# EAGLE design mini-v1.12-macrofab (EAGLE 7.2.0)

## Sheet 1 of 4: Main Microcontroller
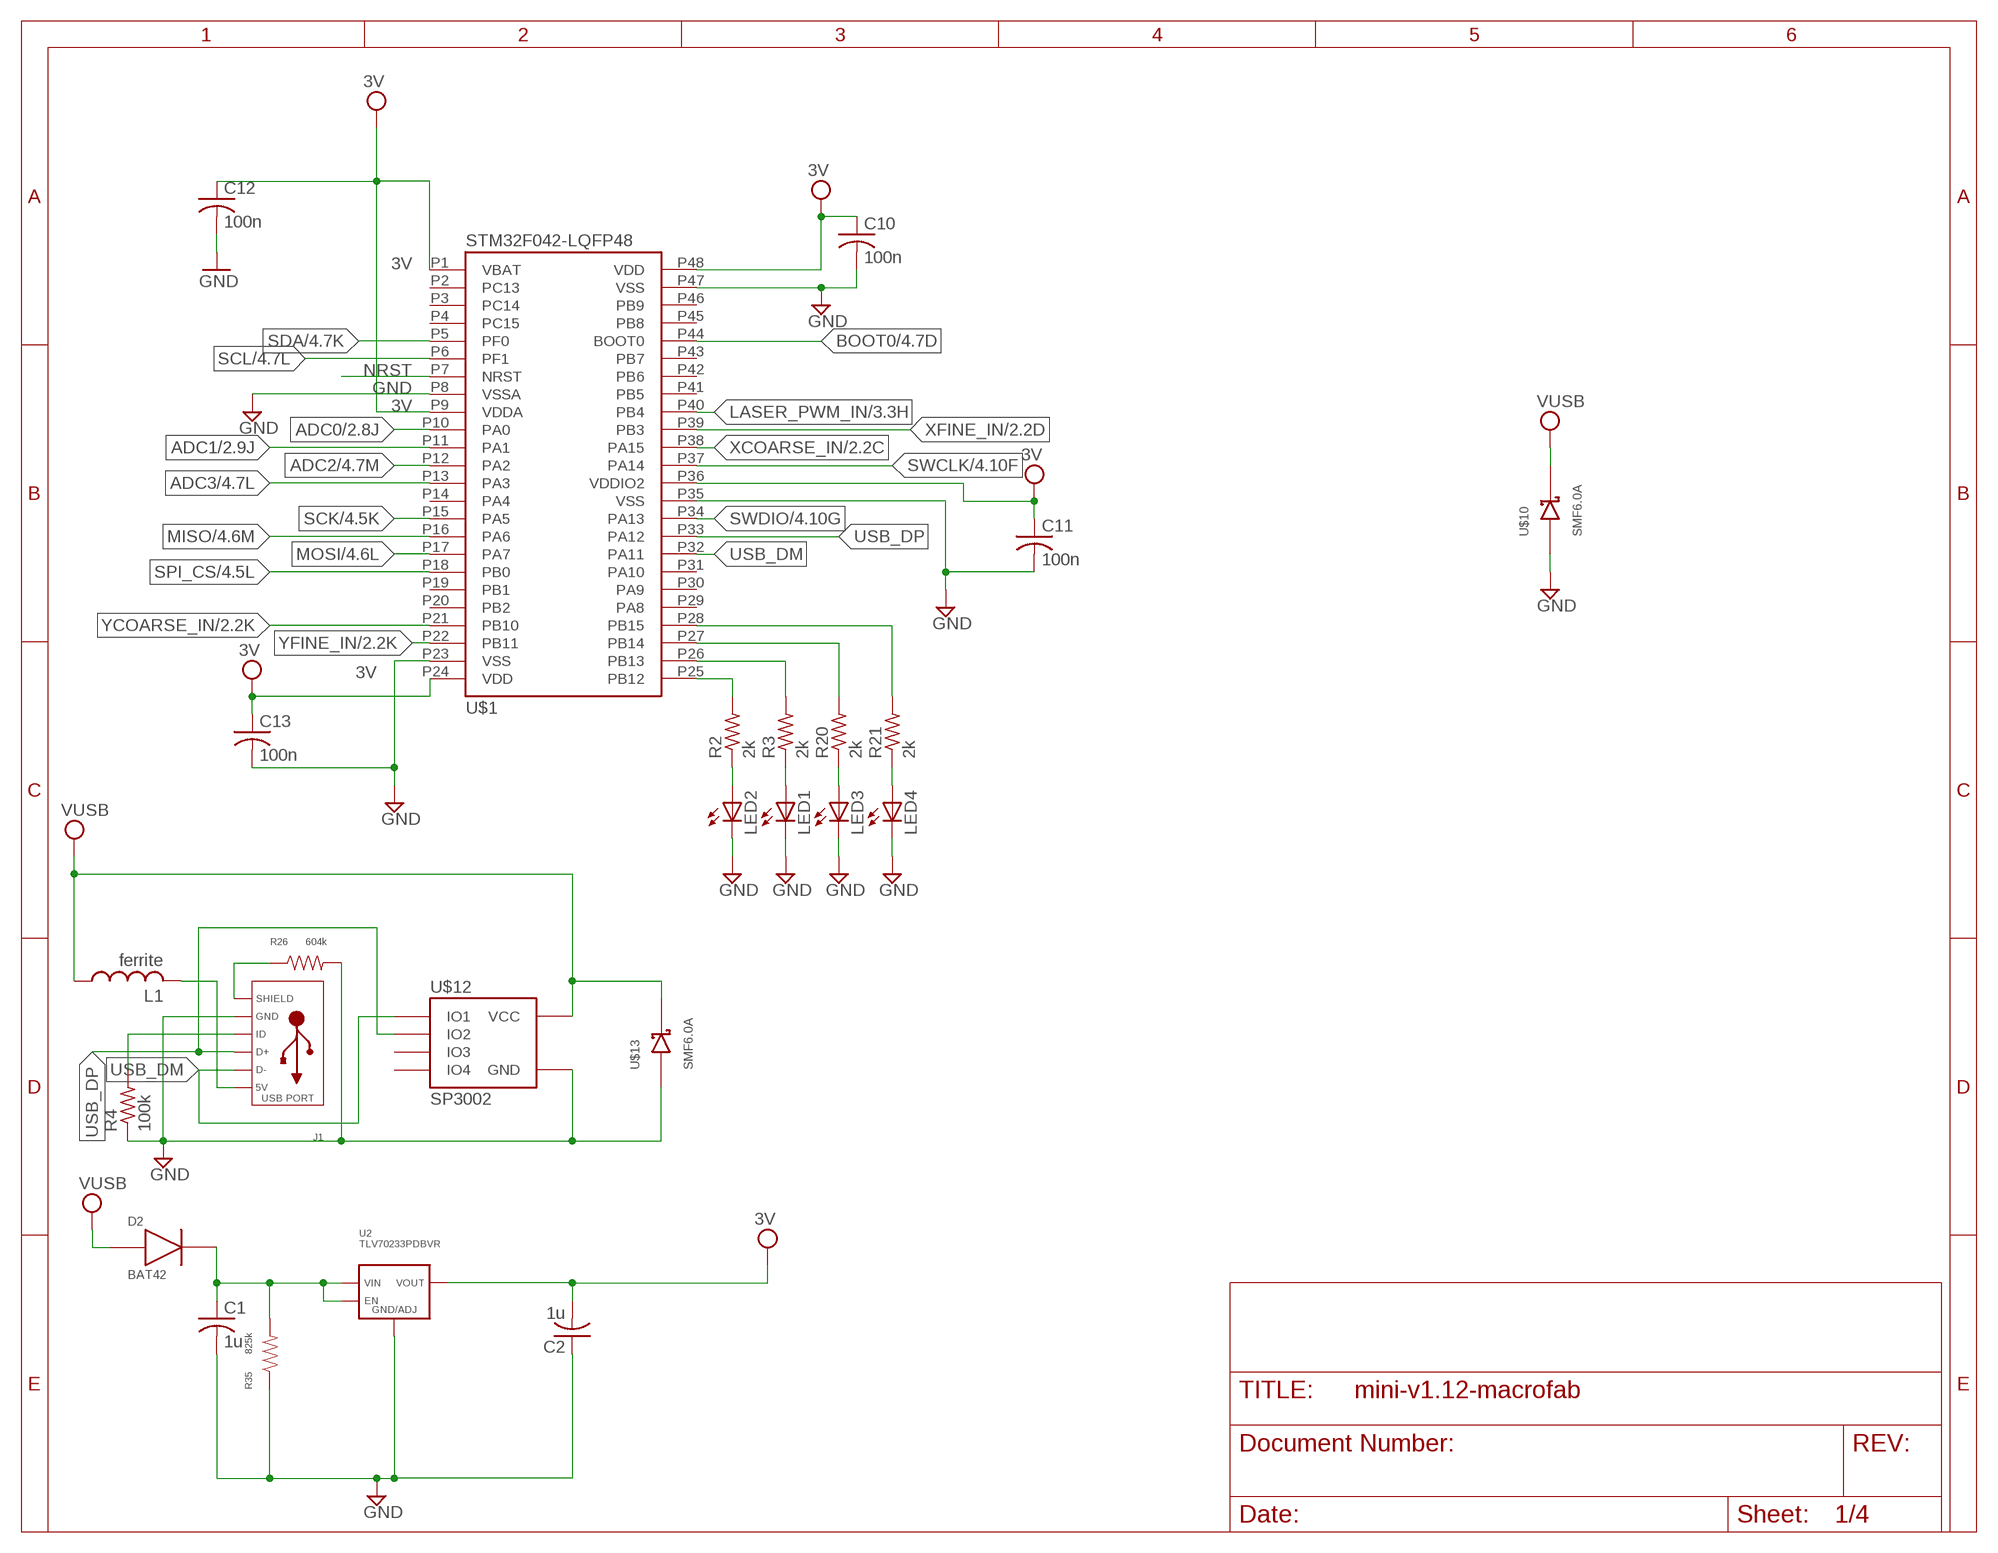
[diagram p0: schematic, sheet 1]

### Parts
C1  1u  C-USC0603  [C0603]
C2  1u  C-USC0603  [C0603]
C10  100n  C-USC0603  [C0603]
C11  100n  C-USC0603  [C0603]
C12  100n  C-USC0603  [C0603]
C13  100n  C-USC0603  [C0603]
D2  BAT42  BAT60A  [SOD323]
J1  USB_MICRO_RIGHT  [MICROUSB-RIGHT]
L1  ferrite  L-US  [C0603]
LED1  LEDCHIP-LED0603  [CHIP-LED0603]
LED2  LEDCHIP-LED0603  [CHIP-LED0603]
LED3  LEDCHIP-LED0603  [CHIP-LED0603]
LED4  LEDCHIP-LED0603  [CHIP-LED0603]
R2  2k  R-US_R0603  [R0603]
R3  2k  R-US_R0603  [R0603]
R4  100k  R-US_R0603  [R0603]
R20  2k  R-US_R0603  [R0603]
R21  2k  R-US_R0603  [R0603]
R26  604k  RESISTOR_0603  [R0603]
R35  825k  RESISTOR_0603  [R0603]
U2  TLV70233PDBVR  [SOT-23-5]
U$1  STM32F042-LQFP48  [LQFP48]
U$10  SMF6.0A  MBR0520  [SOD123]
U$12  SP3002  [SC70-6]
U$13  SMF6.0A  MBR0520  [SOD123]

### Nets
3V: C2.2 C10.1 C11.1 C12.1 C13.1 U2.P$5(VOUT) U$1.P1(VBAT) U$1.P9(VDDA) U$1.P24(VDD) U$1.P36(VDDIO2) U$1.P48(VDD) ; also sheet 2,4
ADC0: U$1.P10(PA0) ; also sheet 2
ADC1: U$1.P11(PA1) ; also sheet 2
ADC2: U$1.P12(PA2) ; also sheet 4
ADC3: U$1.P13(PA3) ; also sheet 4
BOOT0: U$1.P44(BOOT0) ; also sheet 4
GND [Power]: C1.2 C2.1 C10.2 C11.2 C12.2 C13.2 J1.5(GND) LED1.C LED2.C LED3.C LED4.C R4.1 R26.P$2 R35.P$1 U2.P$2(GND/ADJ) U$1.P8(VSSA) U$1.P23(VSS) U$1.P35(VSS) U$1.P47(VSS) U$10.ANODE U$12.P2(GND) U$13.ANODE ; also sheet 2,3,4
LASER_PWM_IN: U$1.P40(PB4) ; also sheet 3
MISO: U$1.P16(PA6) ; also sheet 4
MOSI: U$1.P17(PA7) ; also sheet 4
N$2: R2.2 U$1.P25(PB12)
N$3: LED2.A R2.1
N$4: C1.1 D2.1 R35.P$2 U2.P$1(VIN) U2.P$3(EN)
N$5: J1.4(ID) R4.2
N$12: LED1.A R3.1
N$13: R3.2 U$1.P26(PB13)
N$14: J1.1(5V) L1.2
N$18: J1.S1(SLD) J1.S2(SLD) J1.S3(SLD) J1.S4(SLD) J1.S5(SLD) J1.S6(SLD) R26.P$1
N$24: LED3.A R20.1
N$27: LED4.A R21.1
N$28: R20.2 U$1.P27(PB14)
N$29: R21.2 U$1.P28(PB15)
NRST: U$1.P7(NRST) ; also sheet 4
SCK: U$1.P15(PA5) ; also sheet 4
SCL: U$1.P6(PF1) ; also sheet 4
SDA: U$1.P5(PF0) ; also sheet 4
SPI_CS: U$1.P18(PB0) ; also sheet 4
SWCLK: U$1.P37(PA14) ; also sheet 4
SWDIO: U$1.P34(PA13) ; also sheet 4
USB_DM: J1.2(D-) U$1.P32(PA11) U$12.P1(IO1)
USB_DP: J1.3(D+) U$1.P33(PA12) U$12.P3(IO2)
VUSB [Power]: D2.2 L1.1 U$10.CATHODE U$12.P5(VCC) U$13.CATHODE ; also sheet 2,3,4
XCOARSE_IN: U$1.P38(PA15) ; also sheet 2
XFINE_IN: U$1.P39(PB3) ; also sheet 2
YCOARSE_IN: U$1.P21(PB10) ; also sheet 2
YFINE_IN: U$1.P22(PB11) ; also sheet 2
Unconnected: U$1.P2(PC13) U$1.P3(PC14) U$1.P4(PC15) U$1.P14(PA4) U$1.P19(PB1) U$1.P20(PB2) U$1.P29(PA8) U$1.P30(PA9) U$1.P31(PA10) U$1.P41(PB5) U$1.P42(PB6) U$1.P43(PB7) U$1.P45(PB8) U$1.P46(PB9) U$12.P4(IO3) U$12.P6(IO4)

## Sheet 2 of 4: Dual PWM
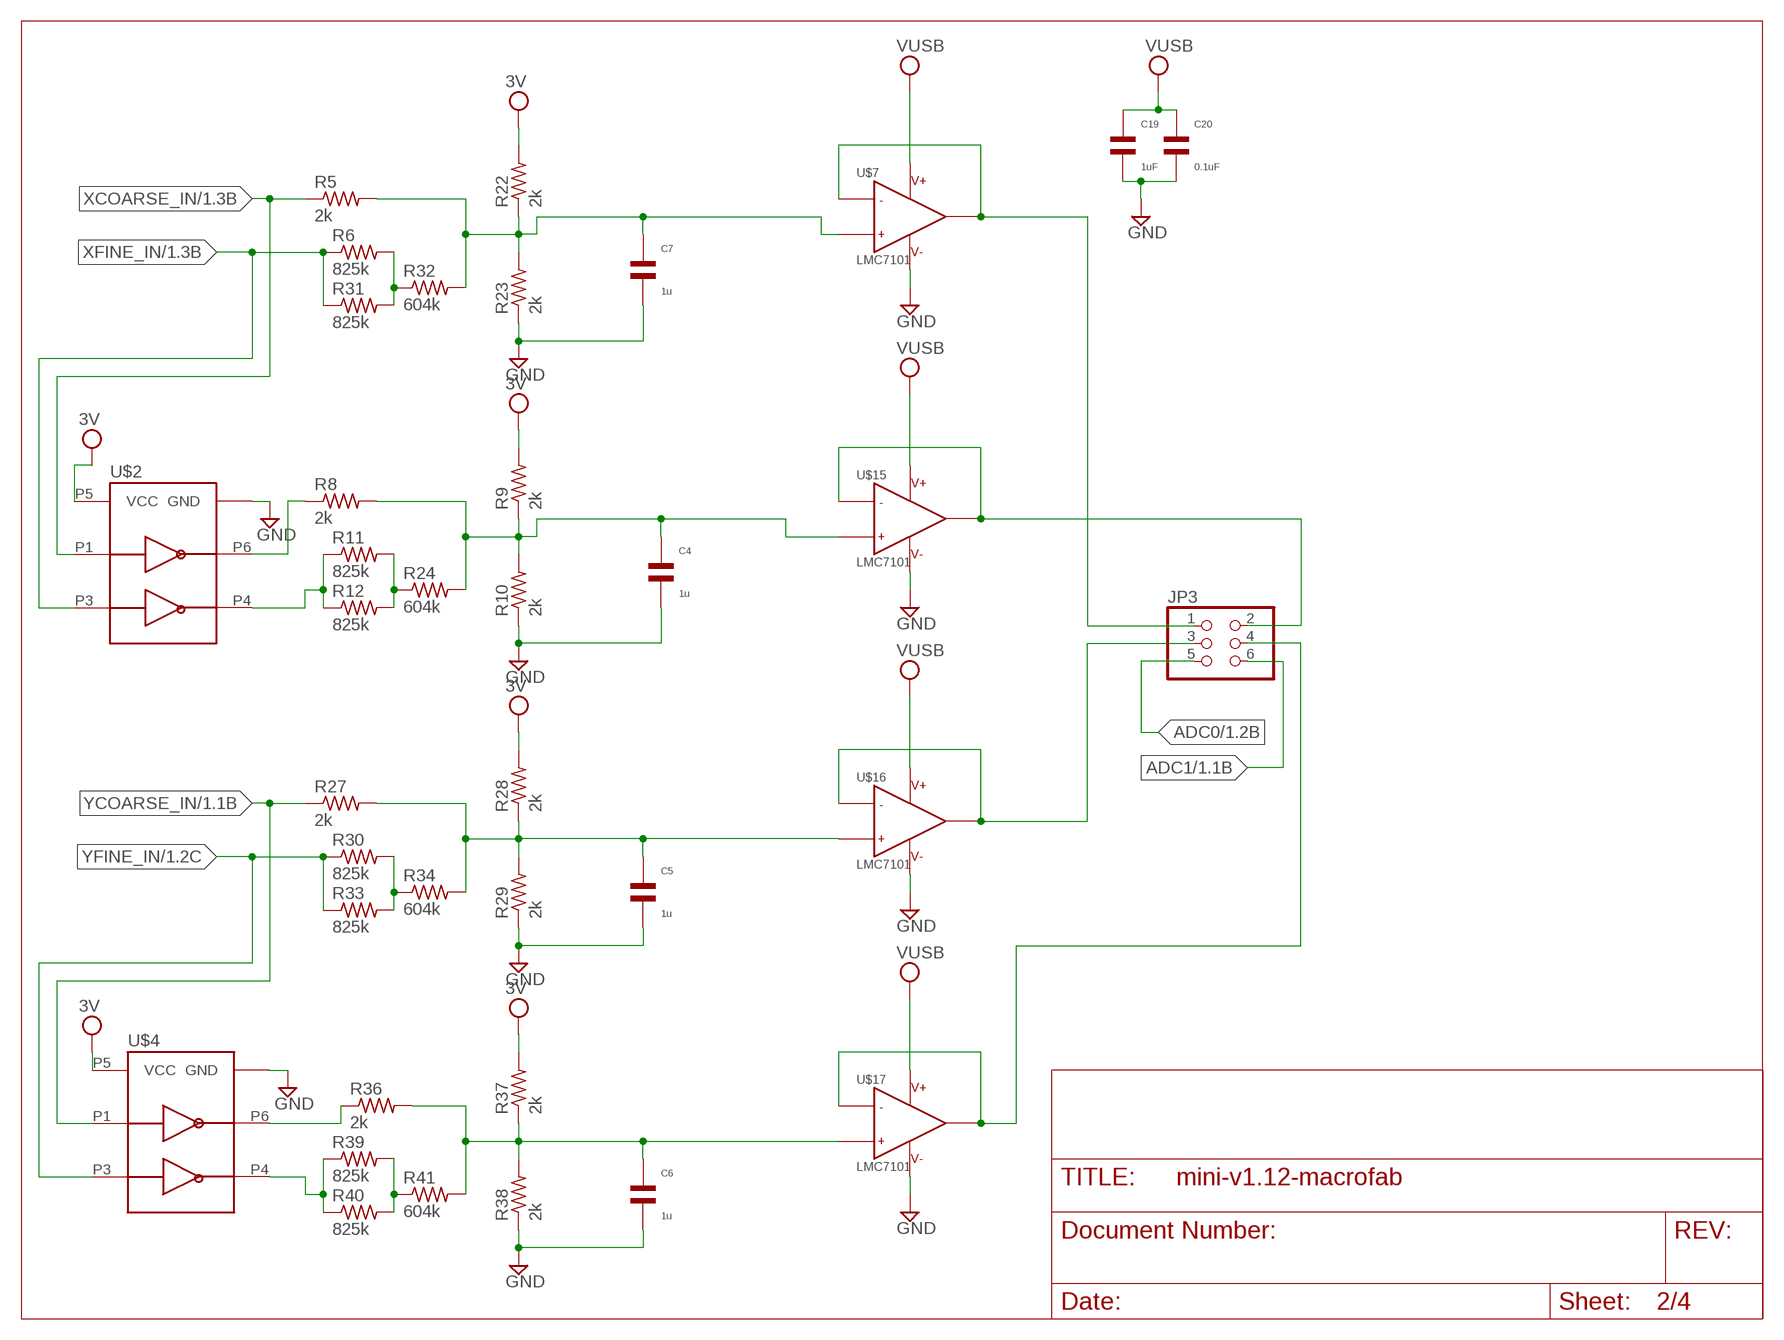
[diagram p1: schematic, sheet 2]

### Parts
C4  1u  CAPACITOR_NP_0603  [C0603]
C5  1u  CAPACITOR_NP_0603  [C0603]
C6  1u  CAPACITOR_NP_0603  [C0603]
C7  1u  CAPACITOR_NP_0603  [C0603]
C19  1uF  CAPACITOR_NP_0603  [C0603]
C20  0.1uF  CAPACITOR_NP_0603  [C0603]
JP3  PINHD-2X3  [2X03]
R5  2k  R-US_R0603  [R0603]
R6  825k  R-US_R0603  [R0603]
R8  2k  R-US_R0603  [R0603]
R9  2k  R-US_R0603  [R0603]
R10  2k  R-US_R0603  [R0603]
R11  825k  R-US_R0603  [R0603]
R12  825k  R-US_R0603  [R0603]
R22  2k  R-US_R0603  [R0603]
R23  2k  R-US_R0603  [R0603]
R24  604k  R-US_R0603  [R0603]
R27  2k  R-US_R0603  [R0603]
R28  2k  R-US_R0603  [R0603]
R29  2k  R-US_R0603  [R0603]
R30  825k  R-US_R0603  [R0603]
R31  825k  R-US_R0603  [R0603]
R32  604k  R-US_R0603  [R0603]
R33  825k  R-US_R0603  [R0603]
R34  604k  R-US_R0603  [R0603]
R36  2k  R-US_R0603  [R0603]
R37  2k  R-US_R0603  [R0603]
R38  2k  R-US_R0603  [R0603]
R39  825k  R-US_R0603  [R0603]
R40  825k  R-US_R0603  [R0603]
R41  604k  R-US_R0603  [R0603]
U$2  NC7WZ14P6X  [SC70-6]
U$4  NC7WZ14P6X  [SC70-6]
U$7  LMC7101  [SOT23-5]
U$15  LMC7101  [SOT23-5]
U$16  LMC7101  [SOT23-5]
U$17  LMC7101  [SOT23-5]

### Nets
3V: R9.2 R22.2 R28.2 R37.2 U$2.P5(VCC) U$4.P5(VCC) ; also sheet 1,4
ADC0: JP3.5 ; also sheet 1
ADC1: JP3.6 ; also sheet 1
COARSE1: R8.1 U$2.P6(Y1)
FINE1: R11.1 R12.1 U$2.P4(Y2)
FINE3: R39.1 R40.1 U$4.P4(Y2)
GND [Power]: C4.P$2 C5.P$2 C6.P$2 C7.P$2 C19.P$2 C20.P$2 R10.1 R23.1 R29.1 R38.1 U$2.P2(GND) U$4.P2(GND) U$7.5 U$15.5 U$16.5 U$17.5 ; also sheet 1,3,4
N$7: R36.1 U$4.P6(Y1)
N$8: R11.2 R12.2 R24.1
N$10: C4.P$1 R8.2 R9.1 R10.2 R24.2 U$15.3
N$30: R30.2 R33.2 R34.1
N$31: R6.2 R31.2 R32.1
N$32: C5.P$1 R27.2 R28.1 R29.2 R34.2 U$16.3
N$35: R39.2 R40.2 R41.1
N$36: C6.P$1 R36.2 R37.1 R38.2 R41.2 U$17.3
OUT: JP3.1 U$7.1 U$7.4
OUT1: JP3.2 U$15.1 U$15.4
OUT2: JP3.3 U$16.1 U$16.4
OUT3: JP3.4 U$17.1 U$17.4
VUSB [Power]: C19.P$1 C20.P$1 U$7.2 U$15.2 U$16.2 U$17.2 ; also sheet 1,3,4
XCOARSE_IN: R5.1 U$2.P1(A1) ; also sheet 1
XFINE_IN: R6.1 R31.1 U$2.P3(A2) ; also sheet 1
XSUM: C7.P$1 R5.2 R22.1 R23.2 R32.2 U$7.3
YCOARSE_IN: R27.1 U$4.P1(A1) ; also sheet 1
YFINE_IN: R30.1 R33.1 U$4.P3(A2) ; also sheet 1

## Sheet 3 of 4: Laser Power Driver
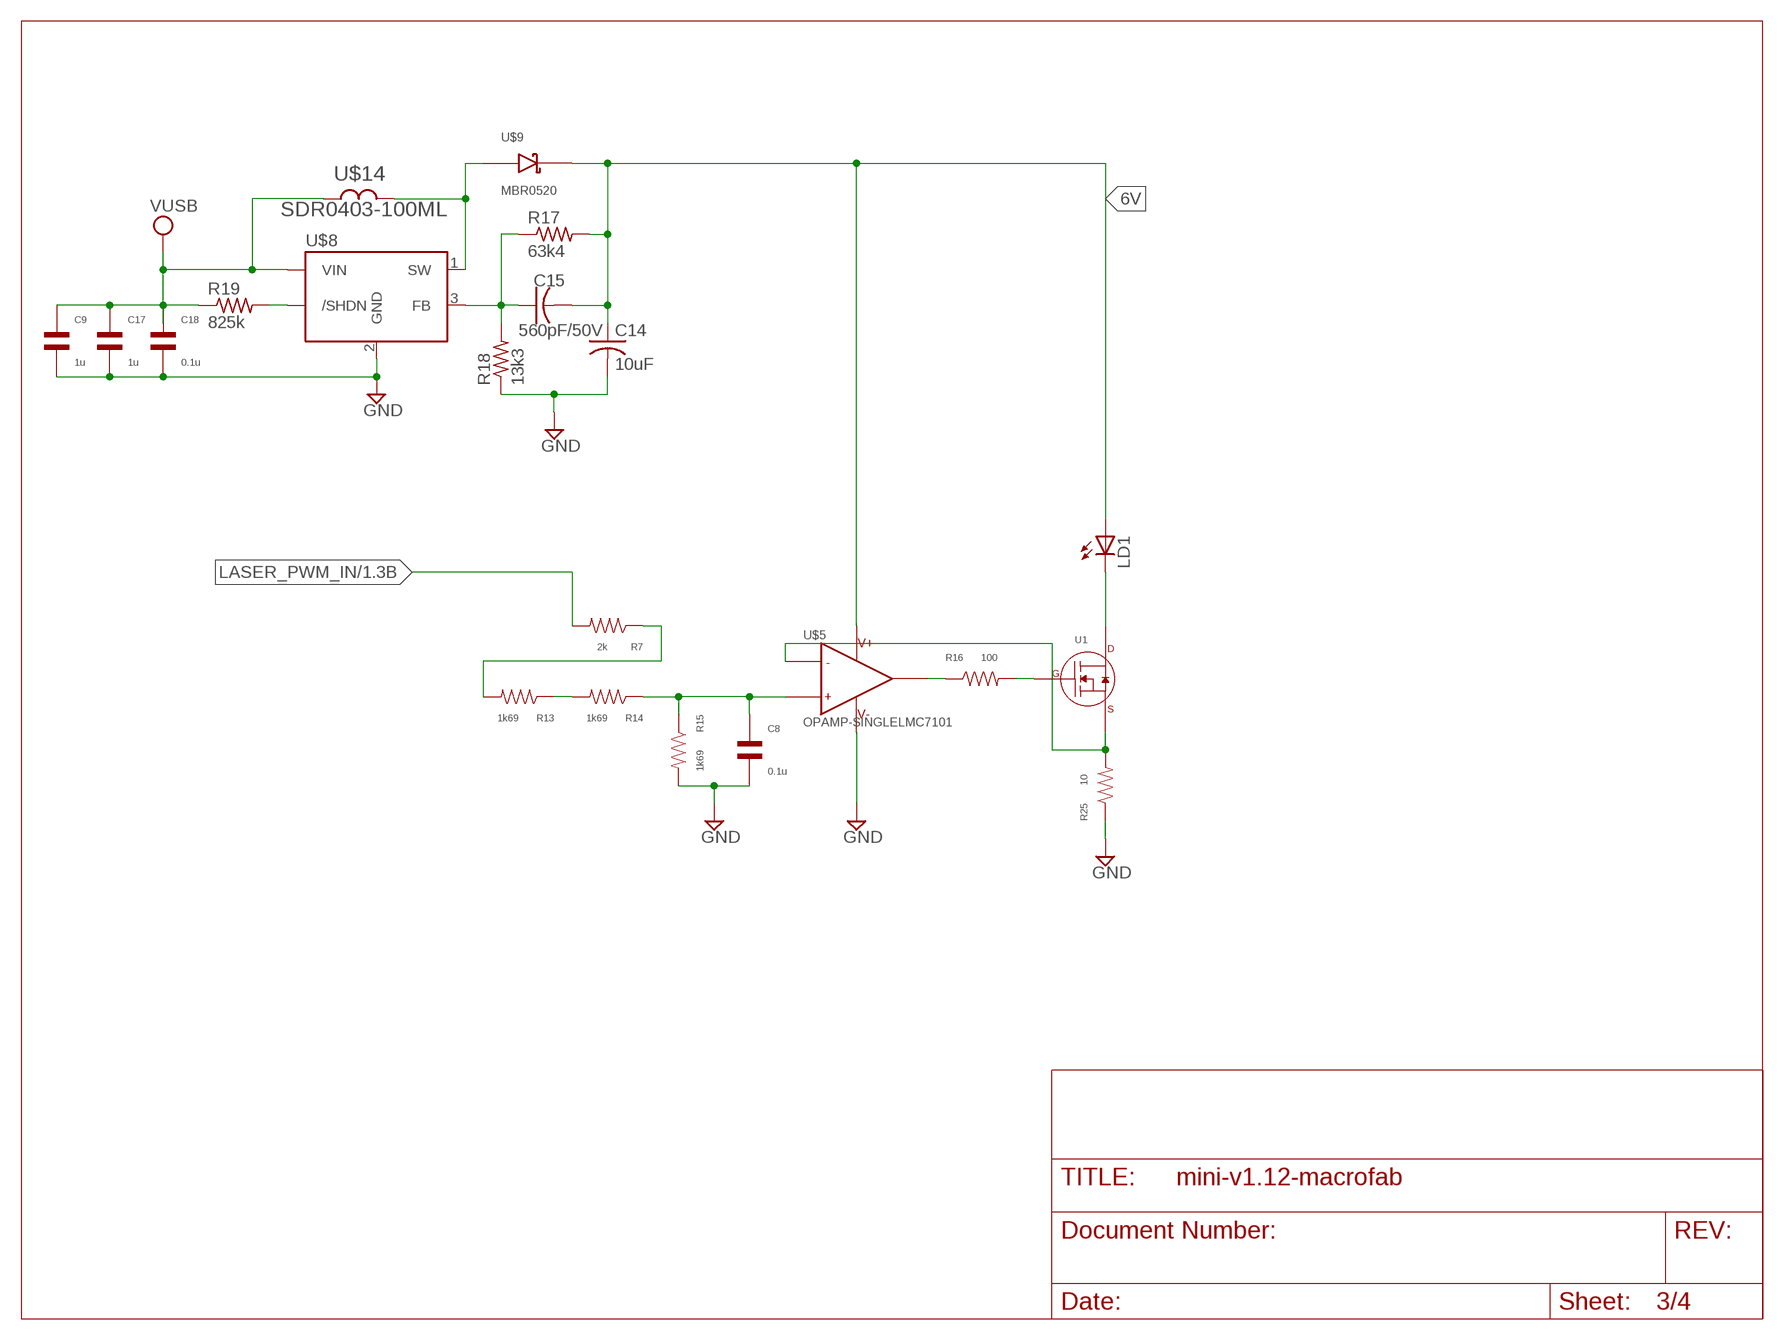
[diagram p2: schematic, sheet 3]

### Parts
C8  0.1u  CAPACITOR_NP_0603  [C0603]
C9  1u  CAPACITOR_NP_0603  [C0603]
C14  10uF  C-USC0603  [C0603]
C15  560pF/50V  C-USC0603  [C0603]
C17  1u  CAPACITOR_NP_0603  [C0603]
C18  0.1u  CAPACITOR_NP_0603  [C0603]
LD1  LASERDIODELD2  [LASERDIODE2]
R7  2k  RESISTOR_0603  [R0603]
R13  1k69  RESISTOR_0603  [R0603]
R14  1k69  RESISTOR_0603  [R0603]
R15  1k69  RESISTOR_0603  [R0603]
R16  100  RESISTOR_0603  [R0603]
R17  63k4  R-US_R0603  [R0603]
R18  13k3  R-US_R0603  [R0603]
R19  825k  R-US_R0603  [R0603]
R25  10  RESISTOR_0603  [R0603]
U1  N-CHANNEL_FET_SOT-23-3  [SOT-23-3]
U$5  OPAMP-SINGLELMC7101  [SOT23-5]
U$8  LMR62014  [SOT23-5]
U$9  MBR0520  [SOD123]
U$14  SDR0403-100ML  SDR0403  [SDR0403]

### Nets
6V [Power]: C14.1 C15.2 LD1.P$1(A) R17.2 U$5.2(V+) U$9.CATHODE
GND [Power]: C8.P$2 C9.P$2 C14.2 C17.P$2 C18.P$2 R15.P$2 R18.1 R25.P$1 U$5.5(V-) U$8.2(GND) ; also sheet 1,2,4
LASER_PWM_IN: R7.P$2 ; also sheet 1
N$6: R7.P$1 R13.P$2
N$9: R13.P$1 R14.P$2
N$11: C8.P$1 R14.P$1 R15.P$1 U$5.3(IN+)
N$15: U$8.1(SW) U$9.ANODE U$14.P$2
N$16 [Power]: LD1.P$3(C) U1.P$3(DRAIN)
N$17 [Power]: R25.P$2 U1.P$2(SOURCE) U$5.4(IN-)
N$19 [Power]: R16.P$2 U1.P$1(GATE)
N$20: R16.P$1 U$5.1(OUT)
N$25: C15.1 R17.1 R18.2 U$8.3(FB)
N$26: R19.2 U$8.4(/SHDN)
VUSB [Power]: C9.P$1 C17.P$1 C18.P$1 R19.1 U$8.5(VIN) U$14.P$1 ; also sheet 1,2,4

## Sheet 4 of 4
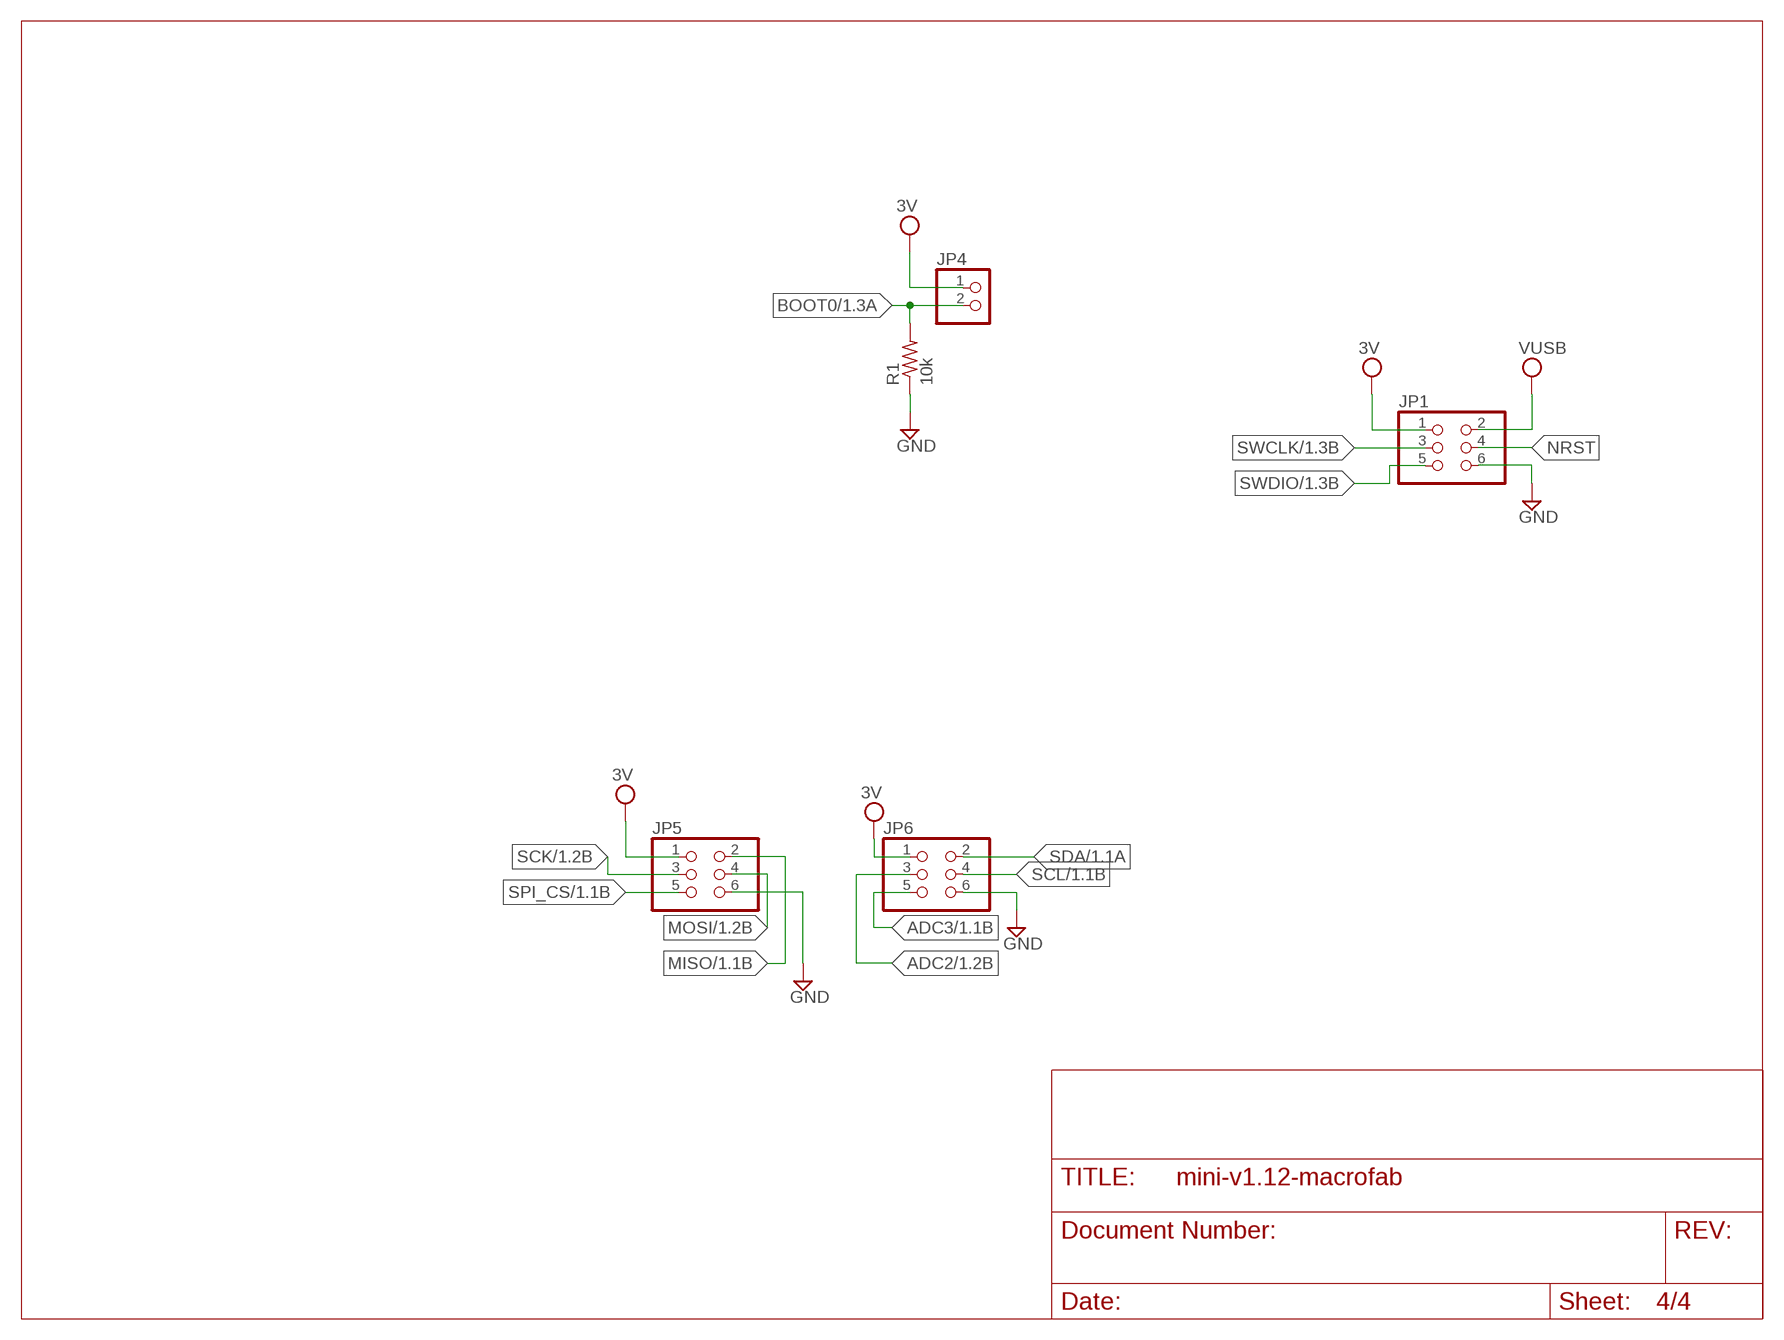
[diagram p3: schematic, sheet 4]

### Parts
JP1  PINHD-2X3  [2X03]
JP4  PINHD-1X2  [1X02]
JP5  PINHD-2X3  [2X03]
JP6  PINHD-2X3  [2X03]
R1  10k  R-US_R0603  [R0603]

### Nets
3V: JP1.1 JP4.1 JP5.1 JP6.1 ; also sheet 1,2
ADC2: JP6.3 ; also sheet 1
ADC3: JP6.5 ; also sheet 1
BOOT0: JP4.2 R1.2 ; also sheet 1
GND [Power]: JP1.6 JP5.6 JP6.6 R1.1 ; also sheet 1,2,3
MISO: JP5.2 ; also sheet 1
MOSI: JP5.4 ; also sheet 1
NRST: JP1.4 ; also sheet 1
SCK: JP5.3 ; also sheet 1
SCL: JP6.4 ; also sheet 1
SDA: JP6.2 ; also sheet 1
SPI_CS: JP5.5 ; also sheet 1
SWCLK: JP1.3 ; also sheet 1
SWDIO: JP1.5 ; also sheet 1
VUSB [Power]: JP1.2 ; also sheet 1,2,3

## Library data of the parts
C1 C2 C10-C15 = rcl:C-US: CAPACITOR, American symbol
C4-C9 C17-C20 = MF_Passives:CAPACITOR_NP: Library: MF_Passives Description: Device for Non-Polarized Capacitors. Manufacture part number (MFG#), Voltage, Temperature Coefficient, and Tolerance can be added via Attributes.; MFG#: N/A; TEMP_COF: N/A; TOLERANCE: N/A; VOLTAGE: N/A
D2 = lmdparts:BAT60A
J1 = MF_Connectors:USB: Library: MF_Connectors Description: 5 Pin USB Connectors. SLD is the shield connection. Usually tied to ground through a small ferrite bead.
JP1 JP3 JP5 JP6 = pinhead:PINHD-2X3: PIN HEADER
JP4 = pinhead:PINHD-1X2: PIN HEADER
L1 = lmdparts:L-US: INDUCTOR, American symbol
LD1 = Scott:LASERDIODE; MPN: 3 x (0552-2-15-15-11-27-10-0)
LED1-LED4 = adafruit:LED: LED OSRAM: - CHIPLED LG R971, LG N971, LY N971, LG Q971, LY Q971, LO R971, LY R971 LH N974, LH R974 LS Q976, LO Q976, LY Q976 LO Q996 - Hyper CHIPLED LW Q18S LB Q993, LB Q99A, LB R99A - SideLED LS A670, LO A670, LY A670, LG A670, LP A670 LB A673, LV A673, LT A673, LW A673 LH A674 LY A675 LS A676, LA A676, LO A676, LY A676, LW A676 LS A679, LY A679, LG A679 - Hyper Micro SIDELED® LS Y876, LA Y876, LO Y876, LY Y876 LT Y87S - SmartLED LW L88C, LW L88S LB L89C, LB L89S, LG L890 LS L89K, LO L89K, LY L89K LS L896, LA L896, LO L896, LY L896 - TOPLED LS T670, LO T670, LY T670, LG T670, LP T670 LSG T670, LSP T670, LSY T670, LOP T670, LYG T670 LG T671, LOG T671, LSG T671 LB T673, LV T673, LT T673, LW T673 LH T674 LS T676, LA T676, LO T676, LY T676, LB T676, LH T676, LSB T676, LW T676 LB T67C, LV T67C, LT T67C, LS T67K, LO T67K, LY T67K, LW E67C LS E67B, LA E67B, LO E67B, LY E67B, LB E67C, LV E67C, LT E67C LW T67C LS T679, LY T679, LG T679 LS T770, LO T770, LY T770, LG T770, LP T770 LB T773, LV T773, LT T773, LW T773 LH T774 LS E675, LA E675, LY E675, LS T675 LS T776, LA T776, LO T776, LY T776, LB T776 LHGB T686 LT T68C, LB T68C - Hyper Mini TOPLED® LB M676 - Mini TOPLED Santana® LG M470 LS M47K, LO M47K, LY M47K Source: http://www.osram.convergy.de/
R1-R6 R8-R12 R17-R24 R27-R34 R36-R41 = rcl:R-US_: RESISTOR, American symbol
R7 R13-R16 R25 R26 R35 = MF_Passives:RESISTOR: Library: MF_Passives Description: Device for Resistors. Manufacture part number (MFG#), Voltage, Tolerance, and Wattage Rating can be added via Attributes.; MFG#: N/A; TOLERANCE: N/A; VOLTAGE: N/A; WATTAGE: N/A
U1 = MF_Discrete_Semiconductor:N-CHANNEL_FET: Library: MF_Discrete_Semiconductor Description: Device for Single N-Channel Mosfet. Manufacture part number (MFG#) can be added via Attributes.
U2 = MF_IC_Power:TLV702: Manufacturer Part #: TLV702 Manufacturer: Texas Instruments Description: LDO Voltage Regulators
U$1 = lmdparts:STM32F042-LQFP48
U$2 U$4 = lmdparts:NC7WZ14P6X: 2-circuit logic inverter, ultra-high-speed and cheap
U$5 = lmdparts:OPAMP-SINGLE: Single amp opamps
U$7 U$15-U$17 = lmdparts:LMC7101
U$8 = lmdparts:LMR62014
U$9 U$10 U$13 = lmdparts:MBR0520
U$12 = lmdparts:SP3002
U$14 = lmdparts:SDR0403

## Net classes
1 Power: width 0.305 mm

## Board
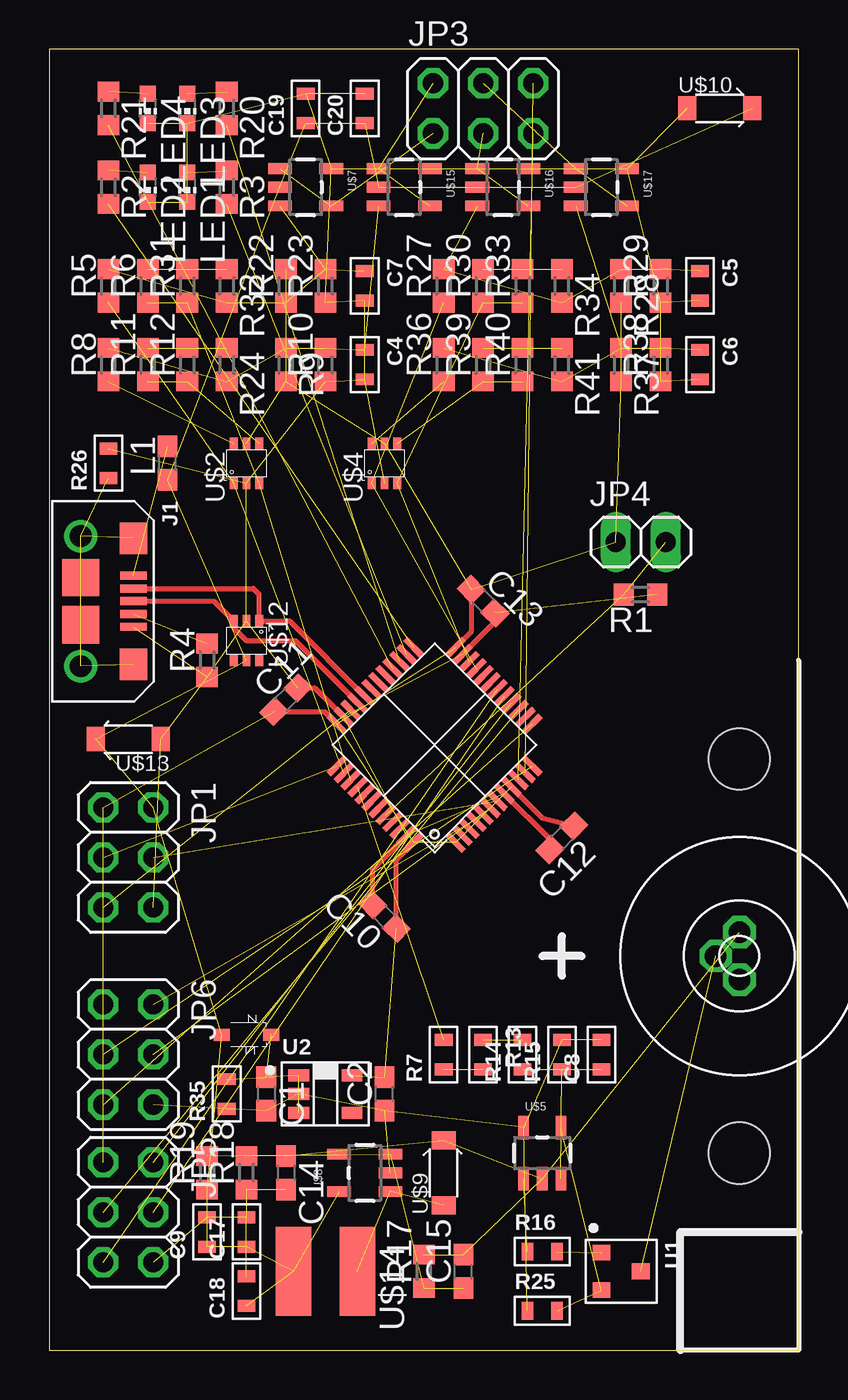
[diagram p4: board, top side]
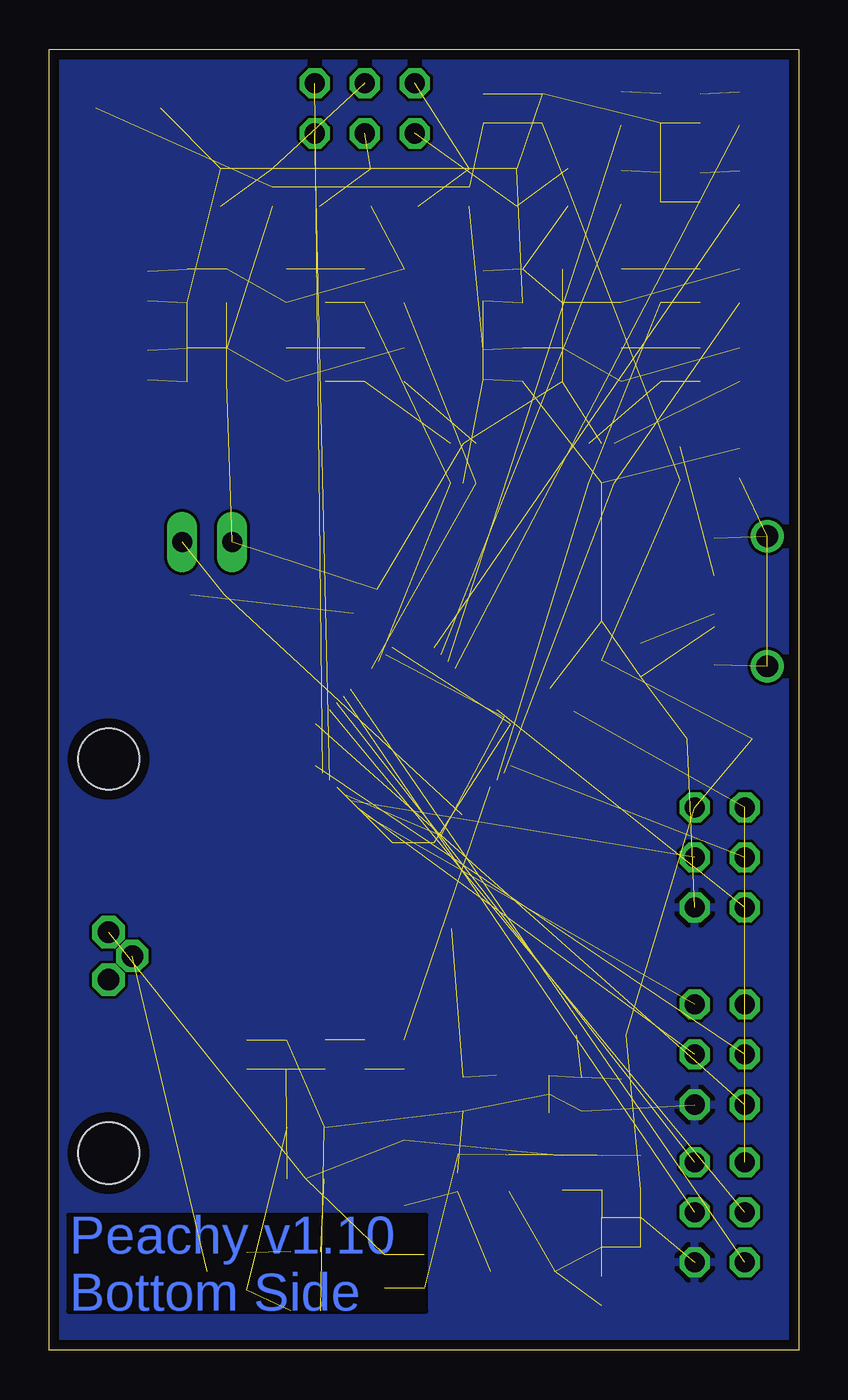
[diagram p5: board, bottom side, seen from below]

Size 38.01 x 66 mm. Coordinates in mm from the lower left corner, seen from the top.
Outline: 0,0 38.01,0 38,66 0,66 0,0
Copper layers (1*16): Top 0.035mm / dielectric 1.5mm / Bottom 0.035mm
Design rules "SeeedStudio_2layer_DRU_no_angle_20140221 *": minimum track width 6mil, minimum drill 12mil, track to track 6mil, track to pad 6mil, pad to pad 6mil, via to via 6mil, smd to smd 0mil, copper to edge 20mil, drill to drill 10mil, minimum pad ring 10mil, minimum via ring 6mil, stop-mask expansion 2mil, vias tented up to drill 100mil, thermal gap 10mil
Holes 3.1 mm at 35,10 35,30

### Footprints (pad centres in the part's own frame; a part is rotated, then mirrored left to right if it is on the bottom)
C0603 = smd 1.1 x 1: 1 -0.85,0; 2 0.85,0
C0603' = smd 0.6 x 0.9: P$1 -0.75,0; P$2 0.75,0
SOD323 = smd 0.6 x 0.8: 1 0,1.25; 2 0,-1.25
MICROUSB-RIGHT = smd 0.4 x 1.35: 1 -1.3,1.27; 2 -0.65,1.27; 3 0,1.27; 4 0.65,1.27; 5 1.3,1.27 | drill 1.1: S1 -3.3,-1.405; S2 3.3,-1.405 | smd 1.6 x 1.4: S3 -3.2,1.27; S4 3.2,1.27 | smd 1.9 x 1.9: S5 -1.2,-1.405; S6 1.2,-1.405
2X03 = drill 1.016 octagon: 1 -2.54,-1.27; 2 -2.54,1.27; 3 0,-1.27; 4 0,1.27; 5 2.54,-1.27; 6 2.54,1.27
1X02 = drill 1.016 long: 1 -1.27,0; 2 1.27,0
LASERDIODE2 = drill 1.092 pad 1.499 octagon: P$1 0,1.203; P$2 0,-1.203; P$3 -1.203,0
CHIP-LED0603 = smd 0.8 x 0.8: A 0,-0.75; C 0,0.75
R0603 = smd 1 x 1.1: 1 -0.85,0; 2 0.85,0
R0603' = smd 0.6 x 0.9: P$1 -0.75,0; P$2 0.75,0
SOT-23-3 = smd 0.8 x 0.9: P$1 -0.95,-1; P$2 0.95,-1; P$3 0,1
SOT-23-5 = smd 1.05 x 0.6: P$1 -1.35,0.95; P$2 -1.35,0; P$3 -1.35,-0.95; P$4 1.35,-0.95; P$5 1.35,0.95
LQFP48 = smd 0.3 x 1.2: P1 -2.75,-0.6; P2 -2.25,-0.6; P3 -1.75,-0.6; P4 -1.25,-0.6; P5 -0.75,-0.6; P6 -0.25,-0.6; P7 0.25,-0.6; P8 0.75,-0.6; P9 1.25,-0.6; P10 1.75,-0.6; P11 2.25,-0.6; P12 2.75,-0.6; P25 2.75,7.9; P26 2.25,7.9; P27 1.75,7.9; P28 1.25,7.9; P29 0.75,7.9; P30 0.25,7.9; P31 -0.25,7.9; P32 -0.75,7.9; P33 -1.25,7.9; P34 -1.75,7.9; P35 -2.25,7.9; P36 -2.75,7.9 | smd 1.2 x 0.3: P13 4.25,0.9; P14 4.25,1.4; P15 4.25,1.9; P16 4.25,2.4; P17 4.25,2.9; P18 4.25,3.4; P19 4.25,3.9; P20 4.25,4.4; P21 4.25,4.9; P22 4.25,5.4; P23 4.25,5.9; P24 4.25,6.4; P37 -4.25,6.4; P38 -4.25,5.9; P39 -4.25,5.4; P40 -4.25,4.9; P41 -4.25,4.4; P42 -4.25,3.9; P43 -4.25,3.4; P44 -4.25,2.9; P45 -4.25,2.4; P46 -4.25,1.9; P47 -4.25,1.4; P48 -4.25,0.9
SC70-6 = smd 0.4 x 0.6: P1 -0.65,-1; P2 0,-1; P3 0.65,-1; P4 0.65,1; P5 0,1; P6 -0.65,1
SOT23-5 = smd 0.55 x 1.2: 1 -0.95,-1.3; 2 0,-1.3; 3 0.95,-1.3; 4 0.95,1.3; 5 -0.95,1.3
SOD123 = smd 0.91 x 1.22: ANODE -1.65,0; CATHODE 1.65,0
SDR0403 = smd 4.5 x 1.8: P$1 0,1.625; P$2 0,-1.625

### Placement (x,y rotation side)
C1  11,13 270 top
C2  17,13 90 top
C4  1u  [C0603']  16,50 270 top
C5  1u  [C0603']  33,54 270 top
C6  1u  [C0603']  33,50 270 top
C7  1u  [C0603']  16,54 270 top
C8  0.1u  [C0603']  28,15 90 top
C9  1u  [C0603']  8,6 90 top
C10  17,22 135 top
C11  12,33 45 top
C12  26,26 225 top
C13  22,38 315 top
C14  12,9 270 top
C15  21,4 90 top
C17  1u  [C0603']  10,6 90 top
C18  0.1u  [C0603']  10,3 90 top
C19  1uF  [C0603']  13,63 90 top
C20  0.1uF  [C0603']  16,63 90 top
D2  10,16 270 top
J1  3,38 270 top
JP1  4,25 270 top
JP3  22,63 0 top
JP4  30,41 0 top
JP5  4,7 270 top
JP6  4,15 270 top
L1  6,45 90 top
LD1  35,20 0 top
LED1  7,59 180 top
LED2  5,59 180 top
LED3  7,63 180 top
LED4  5,63 180 top
R1  29.98,38.34 180 top
R2  3,59 270 top
R3  9,59 270 top
R4  8,35 90 top
R5  3,54 90 top
R6  5,54 90 top
R7  2k  [R0603']  20,15 90 top
R8  3,50 90 top
R9  12,50 270 top
R10  14,50 90 top
R11  5,50 90 top
R12  7,50 90 top
R13  1k69  [R0603']  22,15 270 top
R14  1k69  [R0603']  24,15 90 top
R15  1k69  [R0603']  26,15 90 top
R16  100  [R0603']  25,5 0 top
R17  19,4 90 top
R18  10,9 90 top
R19  8,9 90 top
R20  9,63 270 top
R21  3,63 270 top
R22  12,54 90 top
R23  14,54 90 top
R24  9,50 270 top
R25  10  [R0603']  25,2 0 top
R26  604k  [R0603']  3,45 90 top
R27  20,54 90 top
R28  29,54 270 top
R29  31,54 90 top
R30  22,54 90 top
R31  7,54 90 top
R32  9,54 270 top
R33  24,54 90 top
R34  26,54 270 top
R35  825k  [R0603']  9,13 90 top
R36  20,50 90 top
R37  29,50 270 top
R38  31,50 90 top
R39  22,50 90 top
R40  24,50 90 top
R41  26,50 270 top
U1  29,4 270 top
U2  14,13 0 top
U$1  22.12,28.12 45 top
U$2  10,45 0 top
U$4  17,45 0 top
U$5  25,10 0 top
U$7  13,59 270 top
U$8  16,9 90 top
U$9  20,9 90 top
U$10  34,63 0 top
U$12  10,36 180 top
U$13  4,31 180 top
U$14  14,4 90 top
U$15  18,59 270 top
U$16  23,59 270 top
U$17  28,59 270 top

### Tracks (layer width: path | path; a pad name or v marks a point on that pad's centre or on a via)
3V  (16 unrouted)
  Top 0.254: U$1.P9 25,27 C12.1 | C10.1 17.6,24.87 U$1.P48 | C11.1 13.96,32.4 U$1.P36 | C13.1 21.4,36.45 U$1.P24
6V  (5 unrouted)
ADC0  (1 unrouted)
ADC1  (1 unrouted)
ADC2  (1 unrouted)
ADC3  (1 unrouted)
BOOT0  (2 unrouted)
COARSE1  (1 unrouted)
FINE1  (2 unrouted)
FINE3  (2 unrouted)
GND  (45 unrouted)
  Top 0.254: C12.2 25.4,25.9 U$1.P8 | C10.2 16.4,24.38 U$1.P47 | C11.2 13.46,33.6 U$1.P35 | C13.2 22.6,36.95 U$1.P23
  pour Bottom: 0,0 38,0 38,66 0,66
LASER_PWM_IN  (1 unrouted)
MISO  (1 unrouted)
MOSI  (1 unrouted)
N$2  (1 unrouted)
N$3  (1 unrouted)
N$4  (4 unrouted)
N$5  (1 unrouted)
N$6  (1 unrouted)
N$7  (1 unrouted)
N$8  (2 unrouted)
N$9  (1 unrouted)
N$10  (5 unrouted)
N$11  (3 unrouted)
N$12  (1 unrouted)
N$13  (1 unrouted)
N$14  (1 unrouted)
N$15  (2 unrouted)
N$16  (1 unrouted)
N$17  (2 unrouted)
N$18  (6 unrouted)
N$19  (1 unrouted)
N$20  (1 unrouted)
N$24  (1 unrouted)
N$25  (3 unrouted)
N$26  (1 unrouted)
N$27  (1 unrouted)
N$28  (1 unrouted)
N$29  (1 unrouted)
N$30  (2 unrouted)
N$31  (2 unrouted)
N$32  (5 unrouted)
N$35  (2 unrouted)
N$36  (5 unrouted)
NRST  (1 unrouted)
OUT  (2 unrouted)
OUT1  (2 unrouted)
OUT2  (2 unrouted)
OUT3  (2 unrouted)
SCK  (1 unrouted)
SCL  (1 unrouted)
SDA  (1 unrouted)
SPI_CS  (1 unrouted)
SWCLK  (1 unrouted)
SWDIO  (1 unrouted)
USB_DM
  Top 0.254: J1.2 10.35,38.65 10.62,38.38 10.62,37.02 U$12.P1 12.18,37 U$1.P32
USB_DP
  Top 0.254: J1.3 8.35,38 U$12.P3 9.35,36.65 10,36 12.47,36 U$1.P33
VUSB  (17 unrouted)
XCOARSE_IN  (2 unrouted)
XFINE_IN  (3 unrouted)
XSUM  (5 unrouted)
YCOARSE_IN  (2 unrouted)
YFINE_IN  (3 unrouted)

### Text on the board
Bottom: Peachy v1.10 / Bottom Side